# Altium schematic sheet ESC_B.SchDoc
size A3; SheetNumber: 8; SheetTotal: 10
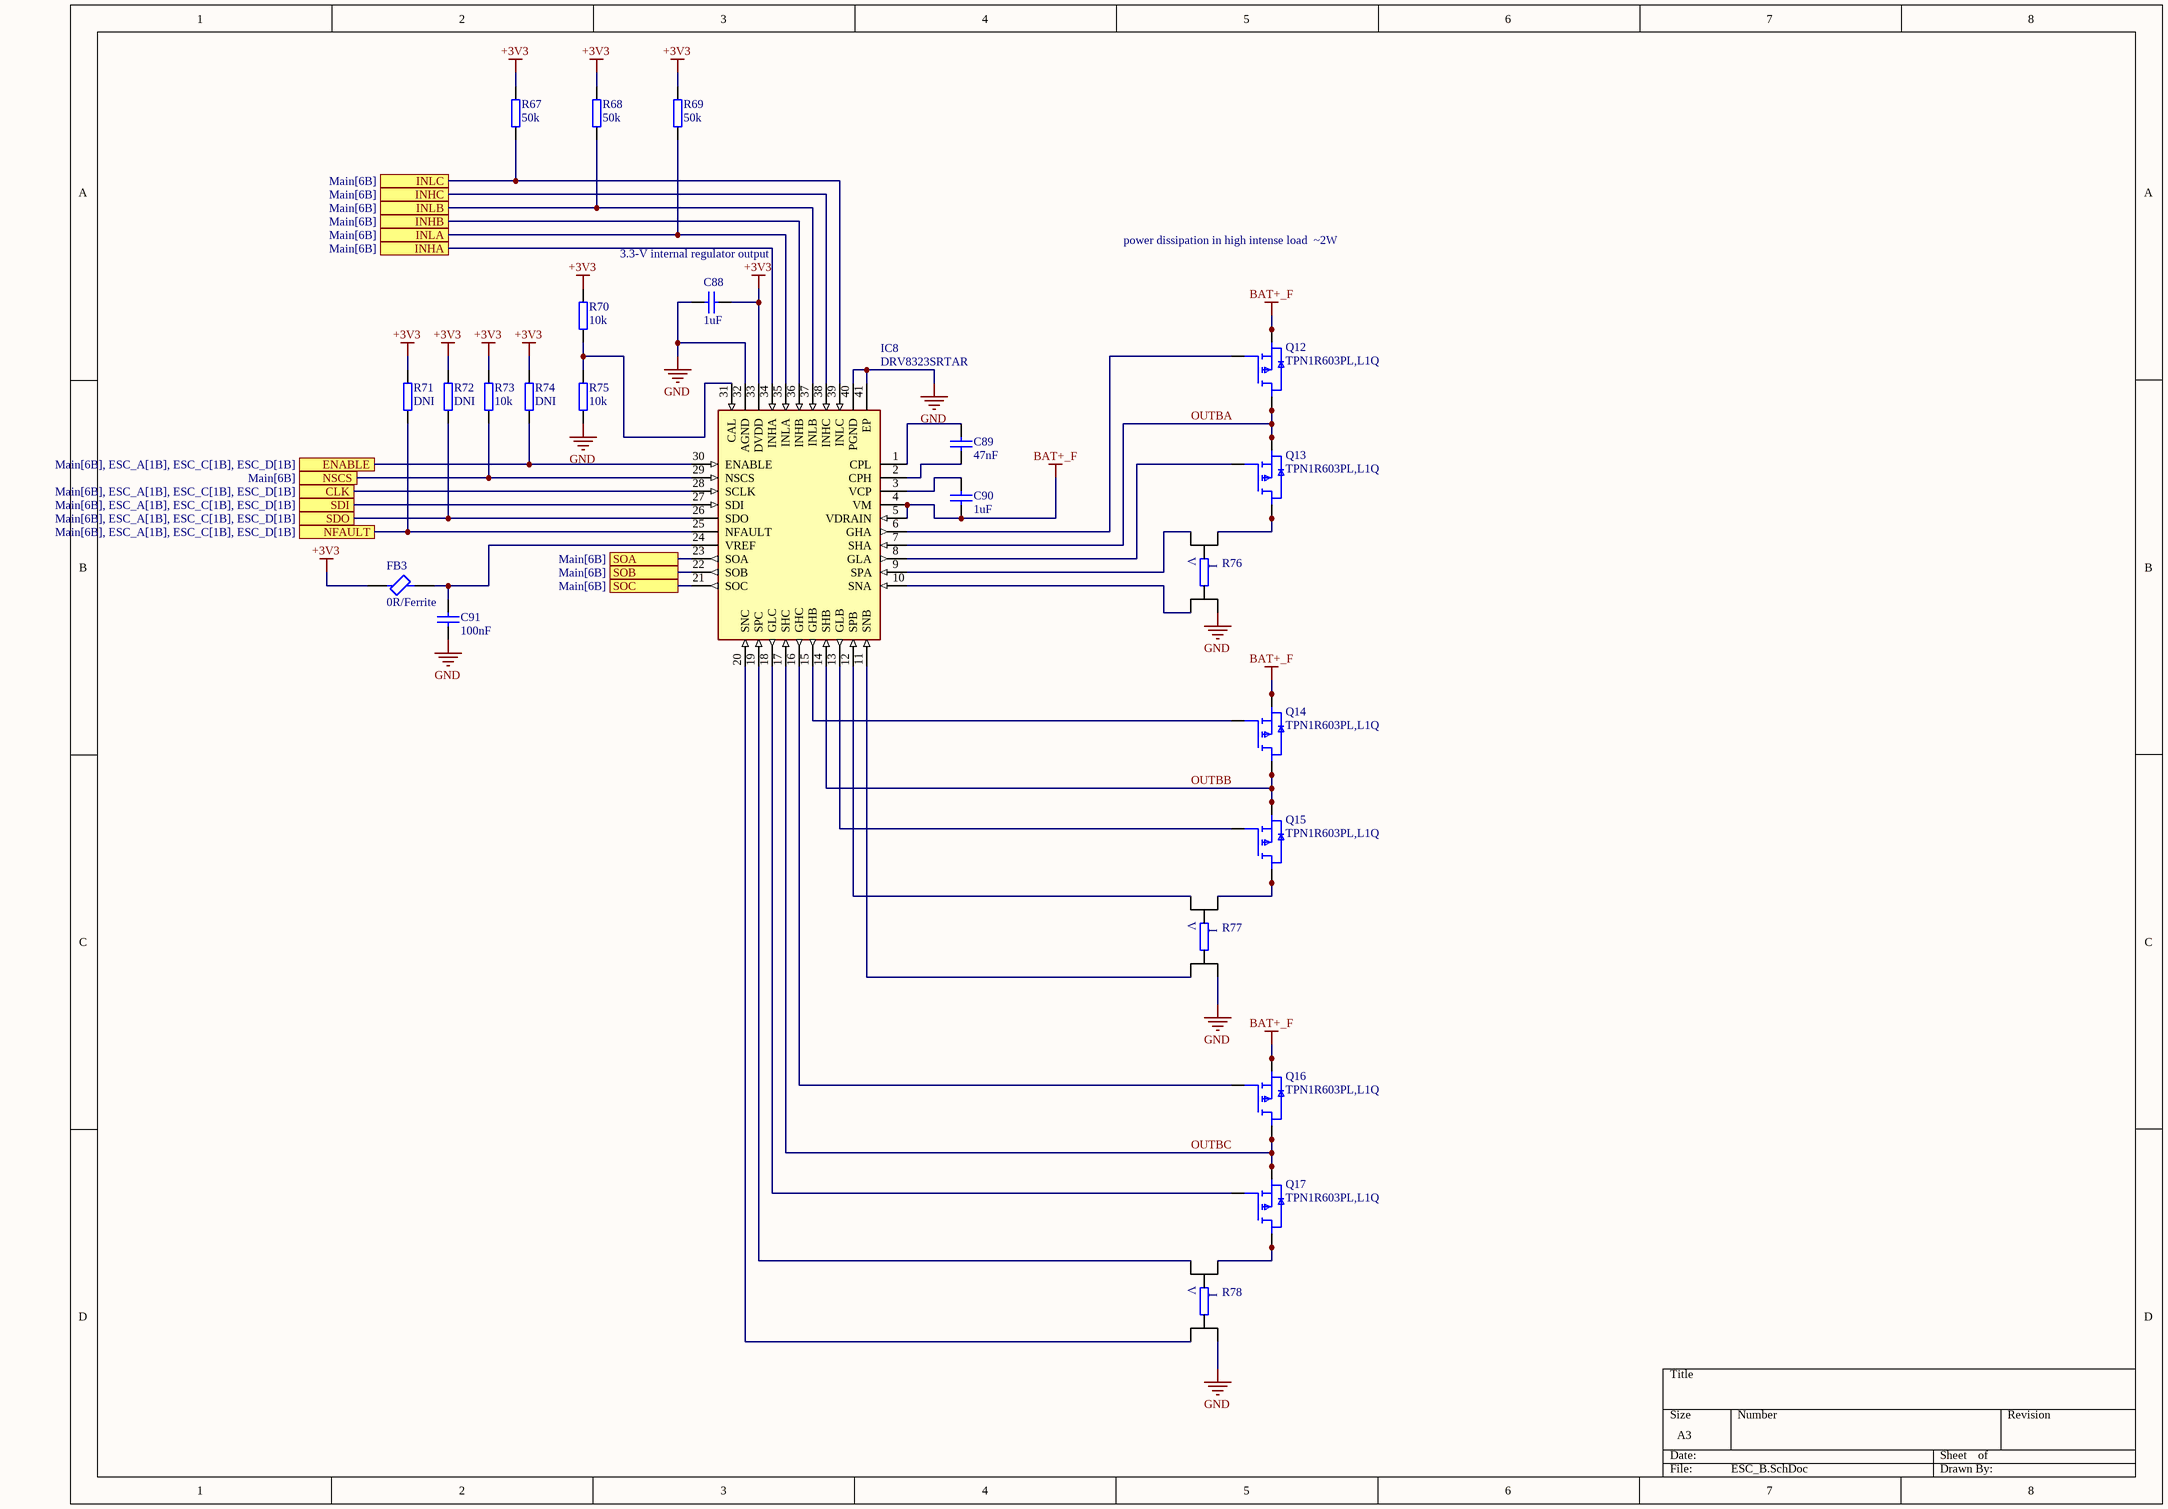
[diagram p0: ESC_B.SchDoc]

## Parts
C88  value 1uF  [CAP0402]  (hidden comment: Cap0402)
C89  value 47nF  [CAP0603]  (hidden comment: Cap0603)
C90  value 1uF  [CAP0603]  (hidden comment: Cap0603)
C91  value 100nF  [CAP0402]  (hidden comment: Cap0402)
FB3  0R/Ferrite  [NFZ15SG152SN10B]
IC8  DRV8323SRTAR  [QFN50P600X600X80-41N-D]
Q12  TPN1R603PL,L1Q  [TPN1R603PLL1Q]
Q13  TPN1R603PL,L1Q  [TPN1R603PLL1Q]
Q14  TPN1R603PL,L1Q  [TPN1R603PLL1Q]
Q15  TPN1R603PL,L1Q  [TPN1R603PLL1Q]
Q16  TPN1R603PL,L1Q  [TPN1R603PLL1Q]
Q17  TPN1R603PL,L1Q  [TPN1R603PLL1Q]
R67  value 50k  [RES0402]  (hidden comment: Res0402)
R68  value 50k  [RES0402]  (hidden comment: Res0402)
R69  value 50k  [RES0402]  (hidden comment: Res0402)
R70  value 10k  [RES0402]  (hidden comment: Res0402)
R71  value DNI  [RES0402]  (hidden comment: Res0402)
R72  value DNI  [RES0402]  (hidden comment: Res0402)
R73  value 10k  [RES0402]  (hidden comment: Res0402)
R74  value DNI  [RES0402]  (hidden comment: Res0402)
R75  value 10k  [RES0402]  (hidden comment: Res0402)
R76  WSK12161L000FEA  [WSK12161L000FEA]  (value not drawn)
R77  WSK12161L000FEA  [WSK12161L000FEA]  (value not drawn)
R78  WSK12161L000FEA  [WSK12161L000FEA]  (value not drawn)

## Ports
CLK (see Main[6B], ESC_A[1B], ESC_C[1B], ESC_D[1B]), ENABLE (see Main[6B], ESC_A[1B], ESC_C[1B], ESC_D[1B]), INHA (see Main[6B]), INHB (see Main[6B]), INHC (see Main[6B]), INLA (see Main[6B]), INLB (see Main[6B]), INLC (see Main[6B]), NFAULT (see Main[6B], ESC_A[1B], ESC_C[1B], ESC_D[1B]), NSCS (see Main[6B]), SDI (see Main[6B], ESC_A[1B], ESC_C[1B], ESC_D[1B]), SDO (see Main[6B], ESC_A[1B], ESC_C[1B], ESC_D[1B]), SOA (see Main[6B]), SOB (see Main[6B]), SOC (see Main[6B])

## Nets
+3V3: C88.2 FB3.1 IC8.33(DVDD) R67.2 R68.2 R69.2 R70.2 R71.2 R72.2 R73.2 R74.2
BAT+_F: C90.1 IC8.4(VM) IC8.5(VDRAIN) Q12.1(S_1) Q12.2(S_2) Q12.3(S_3) Q14.1(S_1) Q14.2(S_2) Q14.3(S_3) Q16.1(S_1) Q16.2(S_2) Q16.3(S_3)
GND: C88.1 C91.1 IC8.32(AGND) IC8.40(PGND) IC8.41(EP) R75.1 R76.4 R77.4 R78.4
CLK: IC8.28(SCLK) ; port CLK
ENABLE: IC8.30(ENABLE) R74.1 ; port ENABLE
INHA: IC8.34(INHA) ; port INHA
INHB: IC8.36(INHB) ; port INHB
INHC: IC8.38(INHC) ; port INHC
INLA: IC8.35(INLA) R69.1 ; port INLA
INLB: IC8.37(INLB) R68.1 ; port INLB
INLC: IC8.39(INLC) R67.1 ; port INLC
NFAULT: IC8.25(NFAULT) R71.1 ; port NFAULT
NSCS: IC8.29(NSCS) R73.1 ; port NSCS
OUTBA: IC8.7(SHA) Q12.5(D_1) Q12.6(D_2) Q12.7(D_3) Q12.8(D_4) Q12.9(D_4) Q13.1(S_1) Q13.2(S_2) Q13.3(S_3)
OUTBB: IC8.14(SHB) Q14.5(D_1) Q14.6(D_2) Q14.7(D_3) Q14.8(D_4) Q14.9(D_4) Q15.1(S_1) Q15.2(S_2) Q15.3(S_3)
OUTBC: IC8.17(SHC) Q16.5(D_1) Q16.6(D_2) Q16.7(D_3) Q16.8(D_4) Q16.9(D_4) Q17.1(S_1) Q17.2(S_2) Q17.3(S_3)
SDI: IC8.27(SDI) ; port SDI
SDO: IC8.26(SDO) R72.1 ; port SDO
SOA: IC8.23(SOA) ; port SOA
SOB: IC8.22(SOB) ; port SOB
SOC: IC8.21(SOC) ; port SOC
NetC89_1: C89.1 IC8.2(CPH)
NetC89_2: C89.2 IC8.1(CPL)
NetC90_2: C90.2 IC8.3(VCP)
NetC91_2: C91.2 FB3.2 IC8.24(VREF)
NetIC8_6: IC8.6(GHA) Q12.4(G)
NetIC8_8: IC8.8(GLA) Q13.4(G)
NetIC8_9: IC8.9(SPA) R76.2
NetIC8_10: IC8.10(SNA) R76.3
NetIC8_11: IC8.11(SNB) R77.3
NetIC8_12: IC8.12(SPB) R77.2
NetIC8_13: IC8.13(GLB) Q15.4(G)
NetIC8_15: IC8.15(GHB) Q14.4(G)
NetIC8_16: IC8.16(GHC) Q16.4(G)
NetIC8_18: IC8.18(GLC) Q17.4(G)
NetIC8_19: IC8.19(SPC) R78.2
NetIC8_20: IC8.20(SNC) R78.3
NetIC8_31: IC8.31(CAL) R70.1 R75.2
NetQ13_5: Q13.5(D_1) Q13.6(D_2) Q13.7(D_3) Q13.8(D_4) Q13.9(D_4) R76.1
NetQ15_5: Q15.5(D_1) Q15.6(D_2) Q15.7(D_3) Q15.8(D_4) Q15.9(D_4) R77.1
NetQ17_5: Q17.5(D_1) Q17.6(D_2) Q17.7(D_3) Q17.8(D_4) Q17.9(D_4) R78.1

## Notes on the sheet
- power dissipation in high intense load  ~2W
- 3.3-V internal regulator output
- (near IC8) Separate grounds?
- (in symbol WSK1216L5000FEA) V; I

## Library data of the parts
C88 = Cap0402: Manufacturer_Part_Number: GRM155R61H105KE05J; Voltage: 50V
C89 C90 = CapSMD0603: 50V; Published: 8-Jun-2000; LatestRevisionDate: 29-May-2009; LatestRevisionNote: IPC-7351 Footprint Added.; PackageReference: C1206; Publisher: Altium Limited; PackageDescription: Chip Capacitor
C91 = Cap0402: Manufacturer_Part_Number: GRM155R71H104ME14D; Voltage: 50V
FB3 = BLM15PE471SH1D: Ferrite Bead; Manufacturer_Name: Murata Electronics; Datasheet Link: https://www.murata.com/en-global/products/productdetail.aspx?cate=luNoiseSupprFilteChipFerriBead&partno=BLM15PE471SH1%23; Height: 0.55mm; Manufacturer_Part_Number: BLM15PE471SH1D; Mouser Part Number: 81-BLM15PE471SH1D; Mouser Price/Stock: https://www.mouser.co.uk/ProductDetail/Murata-Electronics/BLM15PE471SH1D?qs=DRkmTr78QATAY5qAVx1hGA%3D%3D
IC8 = DRV8323SRTAR: Integrated Circuit; Manufacturer_Name: Texas Instruments; Datasheet Link: http://www.ti.com/lit/ds/symlink/drv8323.pdf; Height: 0.8mm; Manufacturer_Part_Number: DRV8323SRTAR; Mouser Part Number: 595-DRV8323SRTAR; Mouser Price/Stock: https://www.mouser.co.uk/ProductDetail/Texas-Instruments/DRV8323SRTAR?qs=u4fy%2FsgLU9P2gpPTX6mffg%3D%3D; Arrow Part Number: DRV8323SRTAR; Arrow Price/Stock: https://www.arrow.com/en/products/drv8323srtar/texas-instruments?utm_currency=USD&region=nac
Q12-Q17 = TPN1R603PL,L1Q: MOSFET (N-Channel); Manufacturer_Name: Toshiba; Datasheet Link: https://toshiba.semicon-storage.com/ap-en/semiconductor/product/mosfets/12v-300v-mosfets/detail.TPN1R603PL.html; Height: 0.9mm; Manufacturer_Part_Number: TPN1R603PL,L1Q; Mouser Part Number: 757-TPN1R603PLL1Q; Mouser Price/Stock: https://www.mouser.co.uk/ProductDetail/Toshiba/TPN1R603PLL1Q?qs=bUPhaerQQeGYpGlYi%252BLguw%3D%3D; Arrow Part Number: TPN1R603PL,L1Q; Arrow Price/Stock: https://www.arrow.com/en/products/tpn1r603pll1q/toshiba?utm_currency=USD&region=nac
R67-R69 = Res0402: Manufacturer_Part_Number: TNPW040249K9DEED
R70 R73 R75 = Res0402: Manufacturer_Part_Number: ERA-2AED103X
R76-R78 = WSK1216L5000FEA: Resistor; Manufacturer_Name: Vishay; Datasheet Link: http://www.vishay.com/docs/30189/wsk1216.pdf; Height: 1.9mm; Manufacturer_Part_Number: WSK1216L5000FEA; Mouser Part Number: 71-WSK1216L5000FEA; Mouser Price/Stock: https://www.mouser.co.uk/ProductDetail/Vishay-Dale/WSK1216L5000FEA?qs=OlC7AqGiEDlM2wGD42LFoQ%3D%3D; Arrow Part Number: WSK1216L5000FEA; Arrow Price/Stock: https://www.arrow.com/en/products/wsk1216l5000fea/vishay?region=nac